# Altium schematic sheet LED0603.schdoc
size 127 x 101 mm
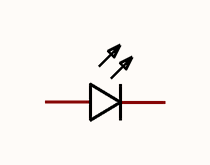
[diagram p0: LED0603.schdoc]

## Parts
LED?  NCD0603G1  [LED0603-RD]  (value not drawn)

## Nets

Not connected (* = marked no-connect by the designer): LED? 1(K) 2(A)

## Library data of the parts
LED? = NCD0603G1: Manufacturer: 国星光电; Symbol: FC-D1608UGK-520D10; Add into BOM: yes; Emitted Color: 翠绿色; Forward Voltage (VF): 2.6V~3.6V; Power Dissipation: 72mW; Forward Current: 10mA; Dominant Wavelength: 515nm~530nm; Lens Color: 无色透明透镜; Luminous Intensity: 330mcd~900mcd; Viewing Angle: 130°; Device: NCD0603G1; LCSC Part Name: NCD0603G1; Supplier Part: C84267; Manufacturer Part: NCD0603G1; Supplier Footprint: 0603; JLCPCB Part Class: Extended Part; Datasheet: https://atta.szlcsc.com/upload/public/pdf/source/20200820/C84267_04BA7703640BAC111D09F5EFB971FBF3.pdf; Supplier: LCSC; Convert to PCB: yes; Operating Temperature: -30℃~+85℃